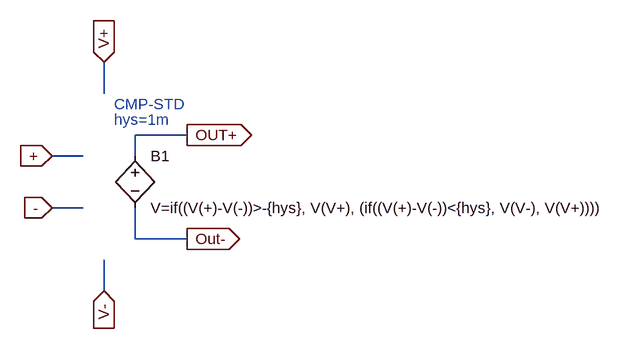
[diagram p0: schematic CMP-STD.asc]
CMP-STD.asc, the LTspice schematic file:
Version 4
SHEET 1 1228 680
WIRE 192 -192 192 -240
WIRE 320 -128 240 -128
WIRE 160 -96 112 -96
WIRE 240 -96 240 -128
WIRE 160 -16 112 -16
WIRE 240 32 240 -16
WIRE 320 32 240 32
WIRE 192 112 192 64
FLAG 112 -96 +
IOPIN 112 -96 In
FLAG 320 -128 OUT+
IOPIN 320 -128 Out
FLAG 112 -16 -
IOPIN 112 -16 In
FLAG 320 32 Out-
IOPIN 320 32 Out
FLAG 192 -240 V+
IOPIN 192 -240 In
FLAG 192 112 V-
IOPIN 192 112 In
SYMBOL bv 240 -112 R0
SYMATTR InstName B1
SYMATTR Value V=if((V(+)-V(-))>-{hys}, V(V+), (if((V(+)-V(-))<{hys}, V(V-), V(V+))))
TEXT 208 -176 Left 0 ;CMP-STD
TEXT 208 -152 Left 0 ;hys=1m

The netlist it stands for:
* CMP-STD.asc
B1 OUT+ Out- V=if((V(+)-V(-))>-{hys}, V(V+), (if((V(+)-V(-))<{hys}, V(V-), V(V+))))
* CMP-STD
* hys=1m
.backanno
.end